# EAGLE design BOT_Input_board (EAGLE 9.6.2)
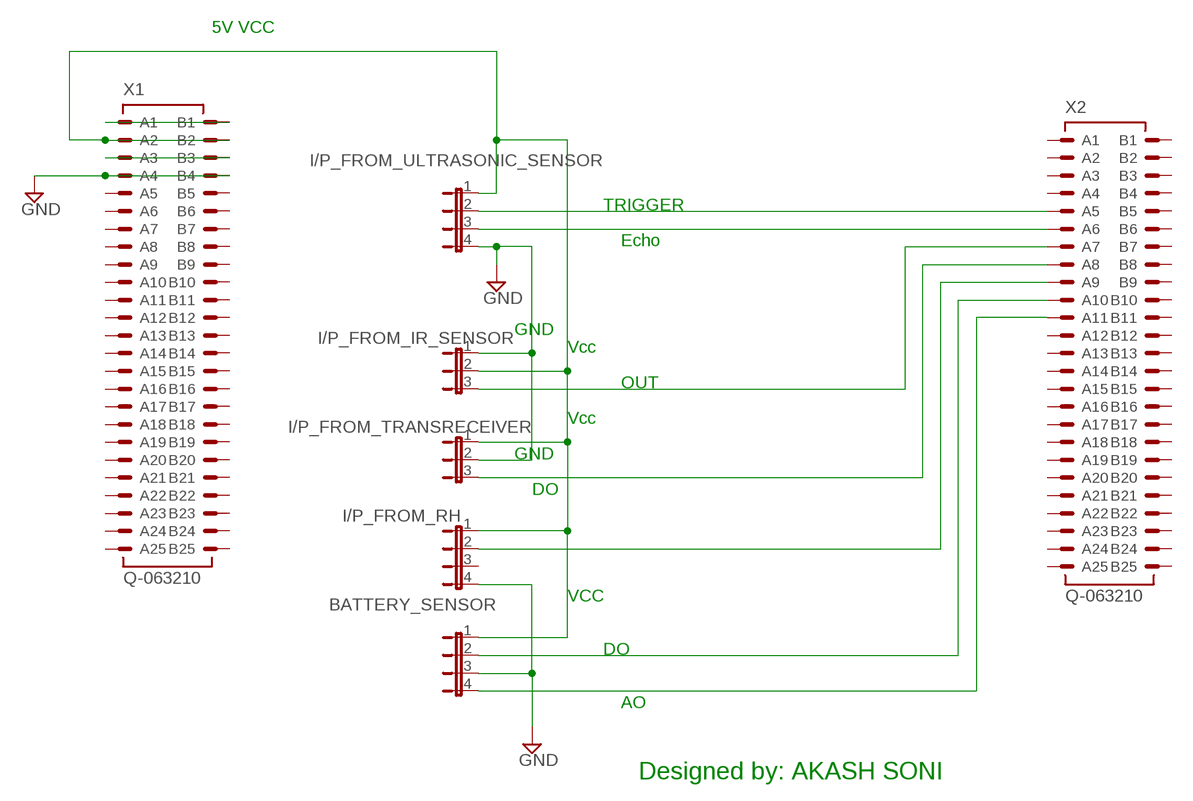
[diagram p0: schematic, sheet 1]

## Parts
BATTERY_SENSOR  JP4E  [JP4]
I/P_FROM_IR_SENSOR  JP2E  [JP2]
I/P_FROM_RH  JP4E  [JP4]
I/P_FROM_TRANSRECEIVER  JP2E  [JP2]
I/P_FROM_ULTRASONIC_SENSOR  JP4E  [JP4]
X1  Q-063210  [063210]
X2  Q-063210  [063210]

## Nets
GND: BATTERY_SENSOR.3 I/P_FROM_IR_SENSOR.1 I/P_FROM_RH.4 I/P_FROM_TRANSRECEIVER.2 I/P_FROM_ULTRASONIC_SENSOR.4 X1.A4 X1.B4
N$1: I/P_FROM_ULTRASONIC_SENSOR.3 X2.A6
N$2: X1.A1 X1.B1
N$3: BATTERY_SENSOR.1 I/P_FROM_IR_SENSOR.2 I/P_FROM_RH.1 I/P_FROM_TRANSRECEIVER.1 I/P_FROM_ULTRASONIC_SENSOR.1 X1.A2 X1.B2
N$4: X1.A3 X1.B3
N$5: I/P_FROM_ULTRASONIC_SENSOR.2 X2.A5
N$6: I/P_FROM_IR_SENSOR.3 X2.A7
N$7: I/P_FROM_TRANSRECEIVER.3 X2.A8
N$8: I/P_FROM_RH.2 X2.A9
N$10: BATTERY_SENSOR.2 X2.A10
N$12: BATTERY_SENSOR.4 X2.A11
Unconnected: I/P_FROM_RH.3 X1.A5 X1.A6 X1.A7 X1.A8 X1.A9 X1.A10 X1.A11 X1.A12 X1.A13 X1.A14 X1.A15 X1.A16 X1.A17 X1.A18 X1.A19 X1.A20 X1.A21 X1.A22 X1.A23 X1.A24 X1.A25 X1.B5 X1.B6 X1.B7 X1.B8 X1.B9 X1.B10 X1.B11 X1.B12 X1.B13 X1.B14 X1.B15 X1.B16 X1.B17 X1.B18 X1.B19 X1.B20 X1.B21 X1.B22 X1.B23 X1.B24 X1.B25 X2.A1 X2.A2 X2.A3 X2.A4 X2.A12 X2.A13 X2.A14 X2.A15 X2.A16 X2.A17 X2.A18 X2.A19 X2.A20 X2.A21 X2.A22 X2.A23 X2.A24 X2.A25 X2.B1 X2.B2 X2.B3 X2.B4 X2.B5 X2.B6 X2.B7 X2.B8 X2.B9 X2.B10 X2.B11 X2.B12 X2.B13 X2.B14 X2.B15 X2.B16 X2.B17 X2.B18 X2.B19 X2.B20 X2.B21 X2.B22 X2.B23 X2.B24 X2.B25

## Notes on the sheet
- 5V VCC
- TRIGGER
- Echo
- GND
- Vcc
- OUT
- Vcc
- GND
- DO
- VCC
- DO
- AO
- Designed by: AKASH SONI

## Library data of the parts
BATTERY_SENSOR I/P_FROM_RH I/P_FROM_ULTRASONIC_SENSOR = jumper:JP4E: JUMPER
I/P_FROM_IR_SENSOR I/P_FROM_TRANSRECEIVER = jumper:JP2E: JUMPER
X1 X2 = con-erni:Q-063210: Male Connector SMC-Q 50 contacts Standard Assembly Height Source: http://www.erni.com/DB/PDF-Drawing/SMC/063210.pdf; OC_FARNELL: unknown; OC_NEWARK: unknown

## Board
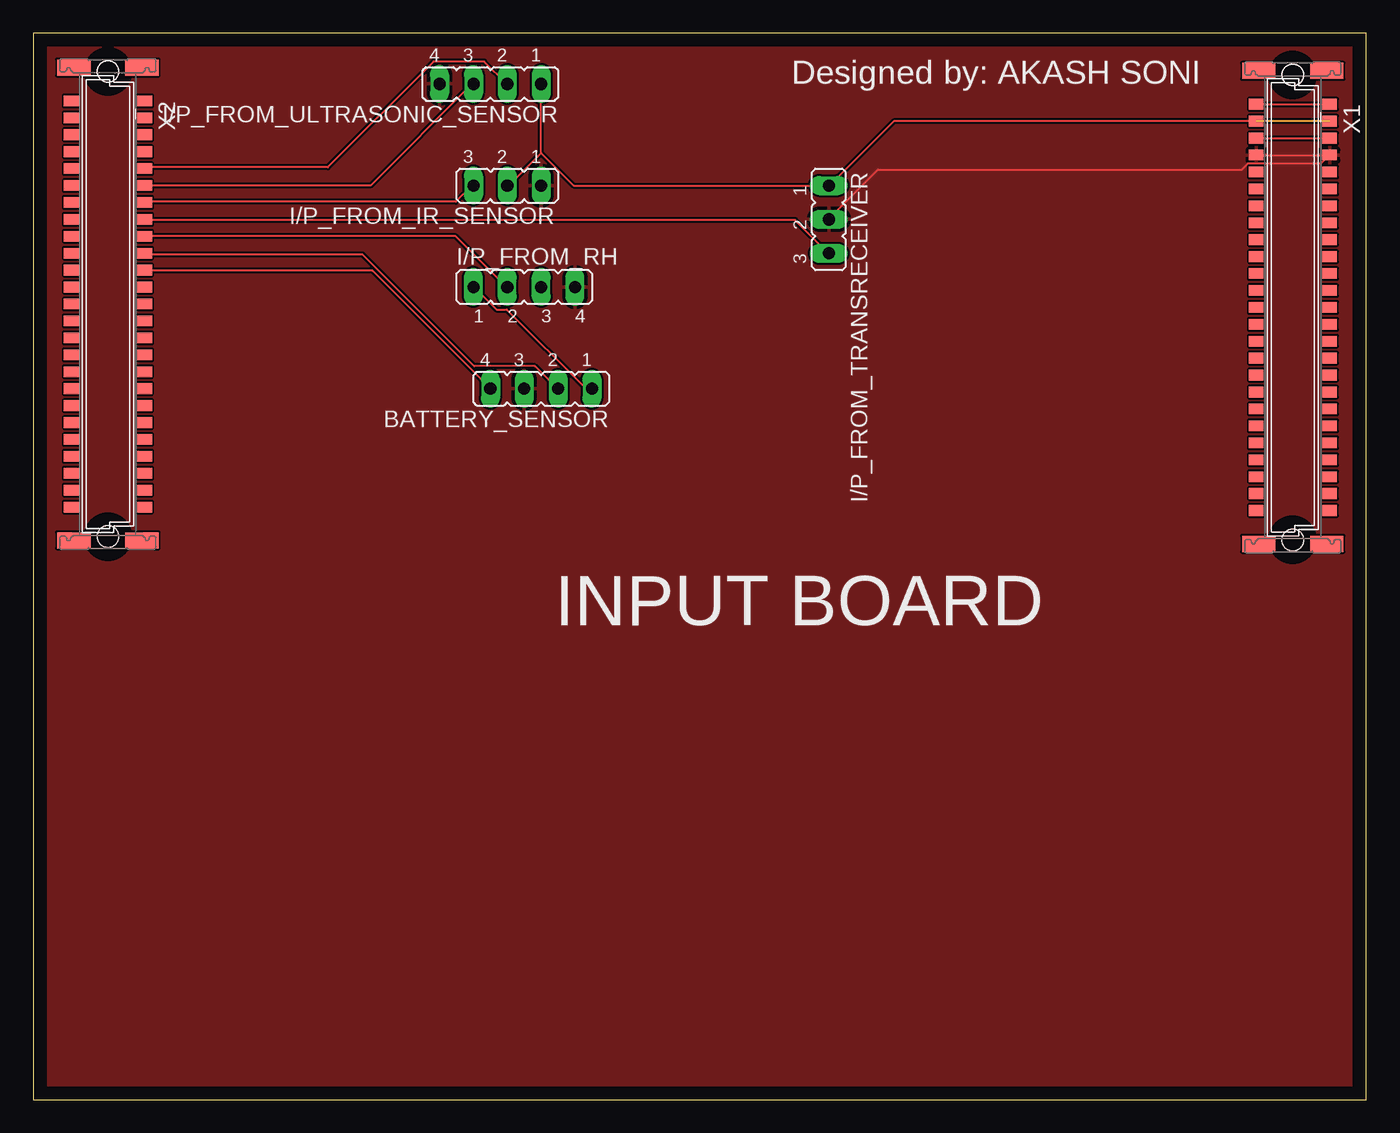
[diagram p1: board, top side]
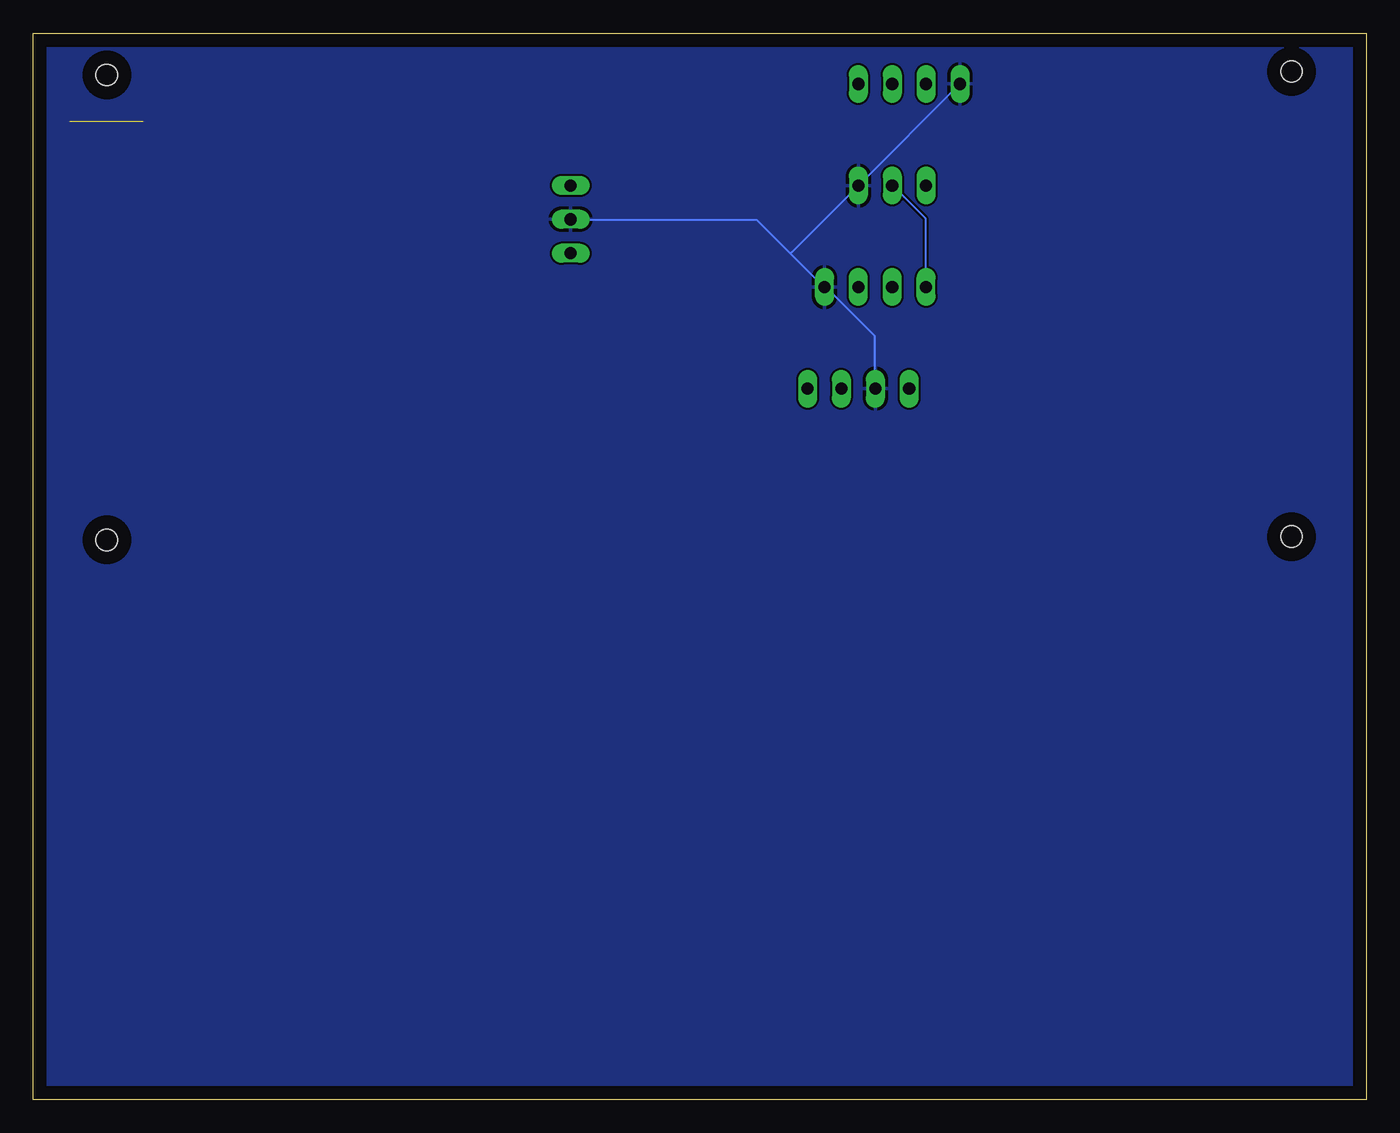
[diagram p2: board, bottom side, seen from below]

Size 100 x 80 mm. Coordinates in mm from the lower left corner, seen from the top.
Outline: 0,0 100,0 100,80 0,80 0,0
Copper layers (1*16): Top 0.035mm / dielectric 1.5mm / Bottom 0.035mm
Design rules "default": minimum track width 6mil, minimum drill 0.35mm, track to track 6mil, track to pad 6mil, pad to pad 6mil, via to via 6mil, smd to smd 6mil, copper to edge 40mil, drill to drill 6mil, minimum pad ring 10mil, minimum via ring 8mil, stop-mask expansion 4mil, vias tented up to drill 0mil, thermal gap 10mil

### Footprints (pad centres in the part's own frame; a part is rotated, then mirrored left to right if it is on the bottom)
JP4 = drill 0.914 long: 1 -3.81,0; 2 -1.27,0; 3 1.27,0; 4 3.81,0
JP2 = drill 0.914 long: 1 -2.54,0; 2 0,0; 3 2.54,0
063210 = smd 0.8 x 1.1: A1 -15.24,2.765; A2 -13.97,2.765; A3 -12.7,2.765; A4 -11.43,2.765; A5 -10.16,2.765; A6 -8.89,2.765; A7 -7.62,2.765; A8 -6.35,2.765; A9 -5.08,2.765; A10 -3.81,2.765; A11 -2.54,2.765; A12 -1.27,2.765; A13 0,2.765; A14 1.27,2.765; A15 2.54,2.765; A16 3.81,2.765; A17 5.08,2.765; A18 6.35,2.765; A19 7.62,2.765; A20 8.89,2.765; A21 10.16,2.765; A22 11.43,2.765; A23 12.7,2.765; A24 13.97,2.765; A25 15.24,2.765; B1 -15.24,-2.74; B2 -13.97,-2.74; B3 -12.7,-2.74; B4 -11.43,-2.74; B5 -10.16,-2.74; B6 -8.89,-2.74; B7 -7.62,-2.74; B8 -6.35,-2.74; B9 -5.08,-2.74; B10 -3.81,-2.74; B11 -2.54,-2.74; B12 -1.27,-2.74; B13 0,-2.74; B14 1.27,-2.74; B15 2.54,-2.74; B16 3.81,-2.74; B17 5.08,-2.74; B18 6.35,-2.74; B19 7.62,-2.74; B20 8.89,-2.74; B21 10.16,-2.74; B22 11.43,-2.74; B23 12.7,-2.74; B24 13.97,-2.74; B25 15.24,-2.74 | smd 1.2 x 2.5: M1 -17.745,2.55; M2 -17.745,-2.55; M3 17.745,-2.55; M4 17.745,2.55 | hole 1.6: -17.45,0; 17.45,0

### Placement (x,y rotation side)
BATTERY_SENSOR  38.1,53.34 180 top
I/P_FROM_IR_SENSOR  35.56,68.58 180 top
I/P_FROM_RH  36.83,60.96 0 top
I/P_FROM_TRANSRECEIVER  59.69,66.04 270 top
I/P_FROM_ULTRASONIC_SENSOR  34.29,76.2 180 top
X1  94.49,59.44 270 top
X2  5.59,59.69 270 top

### Tracks (layer width: path | path; a pad name or v marks a point on that pad's centre or on a via)
GND
  Top 0.152: 63.35,69.75 59.74,66.14 I/P_FROM_TRANSRECEIVER.2 | 63.35,69.75 63.4,69.8 | 63.35,69.75 90.63,69.75 91.1,70.22 96.61,70.22 97.01,70.63 | X1.A4 97.01,70.63 | X1.B4 96.77,70.87 97.01,70.63
  Bottom 0.152: BATTERY_SENSOR.3 36.88,53.34 36.88,57.3 40.54,60.96 I/P_FROM_RH.4 40.69,60.96 43.28,63.55 | 43.28,63.55 45.72,65.99 59.59,65.99 I/P_FROM_TRANSRECEIVER.2 | 43.28,63.55 43.13,63.55 I/P_FROM_IR_SENSOR.1 I/P_FROM_ULTRASONIC_SENSOR.4
  pour Top: -0.51,80.77 -0.51,0.51 -0.51,-0.51 100.58,-0.51 100.58,80.77
  pour Bottom: -1.02,81.28 -1.02,-1.02 101.09,-1.02 101.09,81.28
N$1
  Top 0.152: X2.A6 25.3,68.58 32.92,76.2 I/P_FROM_ULTRASONIC_SENSOR.3
N$2
  Top 0.152: X1.B1 X1.A1
N$3  (1 unrouted)
  Top 0.152: 38.1,71.02 I/P_FROM_ULTRASONIC_SENSOR.1 | 38.1,71.02 35.66,68.58 I/P_FROM_IR_SENSOR.2 | BATTERY_SENSOR.1 41.45,53.34 35.51,59.28 34.75,59.28 33.07,60.96 I/P_FROM_RH.1 | 38.1,71.02 40.54,68.58 I/P_FROM_TRANSRECEIVER.1 59.74,68.58 64.57,73.41 X1.A2
  Bottom 0.152: I/P_FROM_RH.1 33.07,60.96 33.07,66.14 35.51,68.58 I/P_FROM_IR_SENSOR.2
N$4
  Top 0.152: X1.B3 X1.A3
N$5
  Top 0.152: X2.A5 8.48,69.95 22.1,69.95 30.02,77.88 33.83,77.88 35.51,76.2 I/P_FROM_ULTRASONIC_SENSOR.2
N$6
  Top 0.152: X2.A7 8.48,67.36 31.7,67.36 32.92,68.58 I/P_FROM_IR_SENSOR.3
N$7
  Top 0.152: X2.A8 8.48,65.99 57.15,65.99 59.59,63.55 I/P_FROM_TRANSRECEIVER.3
N$8
  Top 0.152: X2.A9 31.7,64.77 35.51,60.96 I/P_FROM_RH.2
N$10
  Top 0.152: X2.A10 8.48,63.4 24.69,63.4 33.07,55.02 37.64,55.02 39.32,53.34 BATTERY_SENSOR.2
N$12
  Top 0.152: BATTERY_SENSOR.4 25.45,62.18 8.48,62.18 X2.A11

### Text on the board
tPlace: Designed by: AKASH SONI | INPUT BOARD